# EAGLE design tm7_revG (EAGLE 9.6.2)
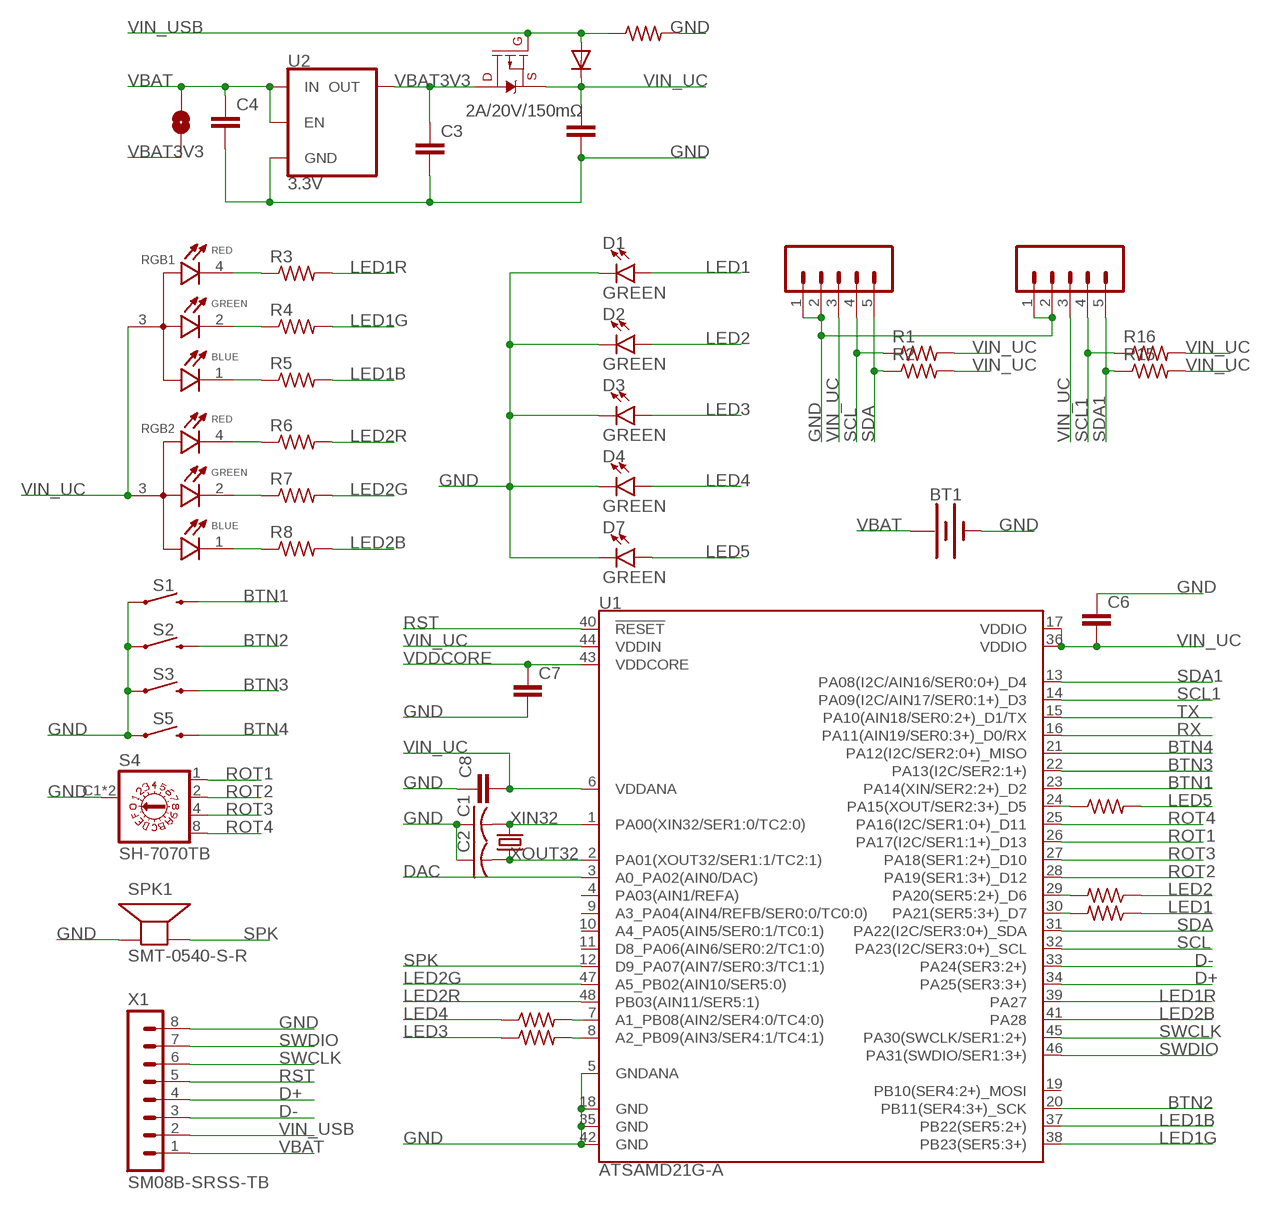
[diagram p0: schematic, sheet 1]

## Parts
BT1  BATTERY-20MM_SMD_4LEGS_OVERPASTE_INNER  [BATTCON_20MM_4LEGS_OVERPASTE_INNER]
C1  C-USC0603  [C0603]
C2  C-USC0603  [C0603]
C3  C-EUC0603  [C0603]
C4  C-EUC0603  [C0603]
C6  C-EUC0603  [C0603]
C7  C-EUC0603  [C0603]
C8  C-EUC0603  [C0603]
C9  C-EUC0603  [C0603]
D1  GREEN  LED-GREEN1206  [LED-1206]
D2  GREEN  LED-GREEN1206  [LED-1206]
D3  GREEN  LED-GREEN1206  [LED-1206]
D4  GREEN  LED-GREEN1206  [LED-1206]
D7  GREEN  LED-GREEN1206  [LED-1206]
D8  DIODESOD-323F  [SOD-323F]
JP1  JUMPER-SMT_2_NO_NO-SILK  [SMT-JUMPER_2_NO_NO-SILK]
LCD1  CONN_05VERT_FEMALE_HEADER  [1X05_SMD_VERTICAL_COMBO]
LCD2  CONN_05VERT_FEMALE_HEADER  [1X05_SMD_VERTICAL_COMBO]
Q1  2A/20V/150mΩ  MOSFET_PCH_DUAL-DMP2240UDM  [SOT26]
R1  R-US_R0603  [R0603]
R2  R-US_R0603  [R0603]
R3  R-US_R0603  [R0603]
R4  R-US_R0603  [R0603]
R5  R-US_R0603  [R0603]
R6  R-US_R0603  [R0603]
R7  R-US_R0603  [R0603]
R8  R-US_R0603  [R0603]
R9  R-US_R0603  [R0603]
R10  R-US_R0603  [R0603]
R11  R-US_R0603  [R0603]
R12  R-US_R0603  [R0603]
R13  R-US_R0603  [R0603]
R14  R-US_R0603  [R0603]
R15  R-US_R0603  [R0603]
R16  R-US_R0603  [R0603]
RGB1  EAST1616RGBA3  [LED_EAST1616RGBA3]
RGB2  EAST1616RGBA3  [LED_EAST1616RGBA3]
S1  MOMENTARY-SWITCH-SPST-SMD-6.0X3.5MM  [TACTILE_SWITCH_SMD_6.0X3.5MM]
S2  MOMENTARY-SWITCH-SPST-SMD-6.0X3.5MM  [TACTILE_SWITCH_SMD_6.0X3.5MM]
S3  MOMENTARY-SWITCH-SPST-SMD-6.0X3.5MM  [TACTILE_SWITCH_SMD_6.0X3.5MM]
S4  SH-7070TB  [SH-7070B]
S5  MOMENTARY-SWITCH-SPST-SMD-6.0X3.5MM  [TACTILE_SWITCH_SMD_6.0X3.5MM]
SPK1  SMT-0540-S-R  [SMT-0540-S-R]
U1  ATSAMD21G-A  [TQFP-48]
U2  3.3V  V_REG_AP2112K-3.3V  [SOT23-5]
X1  SM08B-SRSS-TB  [SM08B-SRSS-TB]
Y1  32.768kHz  CRYSTAL-32.768KHZSMD-3.2X1.5  [CRYSTAL-SMD-3.2X1.5MM]

## Nets
BTN1: S1.2 U1.23(PA14(XIN/SER2:2+)_D2)
BTN2: S2.2 U1.20(PB11(SER4:3+)_SCK)
BTN3: S3.2 U1.22(PA13(I2C/SER2:1+))
BTN4: S5.2 U1.21(PA12(I2C/SER2:0+)_MISO)
D+: U1.34(PA25(SER3:3+)) X1.4
D-: U1.33(PA24(SER3:2+)) X1.3
DAC: U1.3(A0_PA02(AIN0/DAC))
GND: BT1.2(-) C1.1 C2.1 C3.2 C4.2 C6.1 C7.2 C8.1 C9.2 D1.C D2.C D3.C D4.C D7.C LCD1.1 LCD1.2 LCD2.1 LCD2.2 R14.2 S1.1 S2.1 S3.1 S4.C1(C) S4.C2(C) S5.1 SPK1.-(+) U1.5(GNDANA) U1.18(GND) U1.35(GND) U1.42(GND) U2.2(GND) X1.8
LED1: D1.A R9.1
LED1B: R5.2 U1.37(PB22(SER5:2+))
LED1G: R4.2 U1.38(PB23(SER5:3+))
LED1R: R3.2 U1.39(PA27)
LED2: D2.A R10.1
LED2B: R8.2 U1.41(PA28)
LED2G: R7.2 U1.47(A5_PB02(AIN10/SER5:0))
LED2R: R6.2 U1.48(PB03(AIN11/SER5:1))
LED3: D3.A R11.1
LED4: D4.A R12.1
LED5: D7.A R13.2
N$1: R12.2 U1.7(A1_PB08(AIN2/SER4:0/TC4:0))
N$2: R11.2 U1.8(A2_PB09(AIN3/SER4:1/TC4:1))
N$3: R9.2 U1.30(PA21(SER5:3+)_D7)
N$4: R10.2 U1.29(PA20(SER5:2+)_D6)
N$5: R3.1 RGB1.4(R_C)
N$6: R4.1 RGB1.2(G_C)
N$7: R5.1 RGB1.1(B_C)
N$8: R6.1 RGB2.4(R_C)
N$9: R7.1 RGB2.2(G_C)
N$10: R8.1 RGB2.1(B_C)
N$11: R13.1 U1.24(PA15(XOUT/SER2:3+)_D5)
ROT1: S4.1 U1.26(PA17(I2C/SER1:1+)_D13)
ROT2: S4.2 U1.28(PA19(SER1:3+)_D12)
ROT3: S4.4 U1.27(PA18(SER1:2+)_D10)
ROT4: S4.8 U1.25(PA16(I2C/SER1:0+)_D11)
RST: U1.40(!RESET!) X1.5
RX: U1.16(PA11(AIN19/SER0:3+)_D0/RX)
SCL: LCD1.4 R1.1 U1.32(PA23(I2C/SER3:0+)_SCL)
SCL1: LCD2.4 R16.1 U1.14(PA09(I2C/AIN17/SER0:1+)_D3)
SDA: LCD1.5 R2.1 U1.31(PA22(I2C/SER3:0+)_SDA)
SDA1: LCD2.5 R15.1 U1.13(PA08(I2C/AIN16/SER0:0+)_D4)
SPK: SPK1.+(-) U1.12(D9_PA07(AIN7/SER0:3/TC1:1))
SWCLK: U1.45(PA30(SWCLK/SER1:2+)) X1.6
SWDIO: U1.46(PA31(SWDIO/SER1:3+)) X1.7
TX: U1.15(PA10(AIN18/SER0:2+)_D1/TX)
VBAT: BT1.1(+) C4.1 JP1.2 U2.1(IN) U2.3(EN) X1.1
VBAT3V3: C3.1 JP1.1 Q1.D1(A:D) U2.5(OUT)
VDDCORE: C7.1 U1.43(VDDCORE)
VIN_UC: C6.2 C8.2 C9.1 D8.C LCD1.3 LCD2.3 Q1.S1(A:S) R1.2 R2.2 R15.2 R16.2 RGB1.3(A) RGB2.3(A) U1.6(VDDANA) U1.17(VDDIO) U1.36(VDDIO) U1.44(VDDIN)
VIN_USB: D8.A Q1.G1(A:G) R14.1 X1.2
XIN32: C1.2 U1.1(PA00(XIN32/SER1:0/TC2:0)) Y1.P$2
XOUT32: C2.2 U1.2(PA01(XOUT32/SER1:1/TC2:1)) Y1.P$1
Unconnected: Q1.D2(B:D) Q1.G2(B:G) Q1.S2(B:S) U1.4(PA03(AIN1/REFA)) U1.9(A3_PA04(AIN4/REFB/SER0:0/TC0:0)) U1.10(A4_PA05(AIN5/SER0:1/TC0:1)) U1.11(D8_PA06(AIN6/SER0:2/TC1:0)) U1.19(PB10(SER4:2+)_MOSI)

## Library data of the parts
BT1 = SparkFun-Batteries:BATTERY: Battery - Single Cell A variety of battery chemistries, sizes, and footprints. Device List: 20MM_PTH - Coin Cell Battery Holder - 20mm (PTH) <https://www.sparkfun.com/products/783> 20MM_PTH_KIT- Coin Cell battery Holder - 20 mm (PTH) <http://www.sparkfun.com/products/783>kit version with special mask 6.8MM_PTH - Coin Cell Battery Holder - 6.8MM(SMD) <https://www.digikey.com/product-detail/en/seiko-instruments/MS621FE-FL11E/728-1057-ND/1889208?WT.srch=1&gclid=CNOQ5a6LzdQCFZS2wAodXCkE0g> 12MM_SMD - Coin Cell Battery Holder - 12mm (SMD) <https://www.sparkfun.com/products/10592> 12MM_PTH - Coin Cell Battery Holder - 12mm (PTH) <https://www.sparkfun.com/products/7948> 20MM_SMD - 20mm Coin Cell Battery Holder (SMD) (2 legs) Used on the Big Time Watch Kit <https://www.sparkfun.com/products/11734> 20MM_SMD_4LEGS - Coin Cell Battery Holder - 20mm (SMD) <https://www.sparkfun.com/products/11892> 20MM_SMD_4LEGS_OVERPASTE - Coin Cell Battery Holder - 20mm (SMD) <https://www.sparkfun.com/products/11892> (Over-paste on the legs) 24.5MM_PTH - Coin Cell Battery Holder - 24.5mm (PTH) <https://www.sparkfun.com/products/8863> 9V - 9V Battery Holder - PC Mount Used on the SparkFun SparkPunk Sound Kit <https://www.sparkfun.com/products/11177> and SparkFun SparkPunk Sequencer Kit <https://www.sparkfun.com/products/12707> 18650 - Battery Holder - 18650 (PTH) <https://www.sparkfun.com/products/13113> AA - Battery Holder - 1xAA (PTH) <https://www.sparkfun.com/products/7949> AAA - Battery Holder - 1xAAA (PTH) <https://www.sparkfun.com/products/12718> AA_KIT - Battery Holder - 1xAA (PTH) <https://www.sparkfun.com/products/7949> Special kit package - pads only have exposed copper on one side of the board. AAA_KIT - Battery Holder - 1xAAA (PTH) <https://www.sparkfun.com/products/12718> Special kit package - pads only have exposed copper on one side of the board.
C1 C2 = adafruit:C-US: CAPACITOR, American symbol
C3 C4 C6-C9 = rcl:C-EU: CAPACITOR, European symbol; SPICEPREFIX: C
D1-D4 D7 = SparkFun-LED:LED-GREEN: Green SMD LED Used in manufacturing of various products at SparkFun Packages: 0603 - SMD 0603 package [Product Link] <http://www.futureelectronics.com/en/technologies/semiconductors/optoelectronics/leds/Pages/9894312-LTST-C190GKT.aspx?CrossPart=HSMG-C190&IM=0> LilyPad 1206 - SMD1206 LilyPad package [Product Link] <http://www.futureelectronics.com/en/Technologies/Product.aspx?ProductID=IN150NGHARVATEKCORPORATION2049943&IM=0> 1206 - SMD1206 package [Product Link] <http://www.futureelectronics.com/en/technologies/semiconductors/optoelectronics/leds/Pages/8315665-LTST-C150KGKT.aspx?IM=0> 1206 Bottom Mount -SMD 1206 Bottom Mount [Product Link] <http://www.digikey.com/product-detail/en/lite-on-inc/LTST-C230KGKT/160-1456-1-ND/386854> SparkFun Products: Pro Mini 328 -5V <https://www.sparkfun.com/products/821> RedBoard <https://www.sparkfun.com/products/12757> MP3 Trigger <https://www.sparkfun.com/products/13720> Makey Makey <https://www.sparkfun.com/products/11076>; PROD_ID: DIO-00862
D8 = adafruit:DIODE: Diode SMADIODE - SMA Surface Mount Package 20V 1A Schottky Diode Digikey: 641-1014-6-ND DO-1N4148 - Through Hole Small Current Diode SOD-123 20V 1 A (.5mV Vf) Schottky Diode - Digikey: MBRX120TPMSCT-ND SOD-323 10V 570mA (.38mV Vf, 3ns) Schottky Diode - Digikey: ZLLS410CT-ND SOD-523 30V 30mA Schottky Diode (RB751S-40TE61) - Digikey: RB751S-40TE61CT-ND SOT23-R/W - SOT23 Package (R = Solder Paste/Reflow Ovens, W = Hand-Soldering) BAT54Film 40V 300mA - Digikey: 497-7162-1-ND
JP1 = SparkFun-Jumpers:JUMPER-SMT_2_NO: Normally open jumper This jumper has two pads in close proximity to each other. Apply solder to close the connection. Round pads are easier to solder for beginners, but are a lot larger. SparkFun Product that uses the round pads: SparkFun EL Sequencer <https://www.sparkfun.com/products/12781>
LCD1 LCD2 = SparkFun-Connectors:CONN_05: Multi connection point. Often used as Generic Header-pin footprint for 0.1 inch spaced/style header connections On any of the 0.1 inch spaced packages, you can populate with these: Break Away Headers - Straight <https://www.sparkfun.com/products/116> (PRT-00116) Break Away Male Headers - Right Angle <https://www.sparkfun.com/products/553> (PRT-00553) Female Headers <https://www.sparkfun.com/products/115> (PRT-00115) Break Away Headers - Machine Pin <https://www.sparkfun.com/products/117> (PRT-00117) Break Away Female Headers - Swiss Machine Pin <https://www.sparkfun.com/products/743> (PRT-00743) For SCREWTERMINALS and SPRING TERMINALS visit here: Screw Terimnals on SparkFun.com <https://www.sparkfun.com/search/results?term=Screw+Terminals> (5mm/3.5mm/2.54mm spacing) This device is also useful as a general connection point to wire up your design to another part of your project. Our various solder wires solder well into these plated through hole pads. Hook-Up Wire - Assortment (Stranded, 22 AWG) <https://www.sparkfun.com/products/11375> (PRT-11375) Hook-Up Wire - Assortment (Solid Core, 22 AWG) <https://www.sparkfun.com/products/11367> (PRT-11367) View the entire wire category on our website here <https://www.sparkfun.com/categories/141> Special notes: Molex polarized connector foot print use with SKU : PRT-08231 with associated crimp pins and housings. 1MM SMD Version SKU: PRT-10208; PROD_ID: CONN-15262
Q1 = SparkFun-DiscreteSemi:MOSFET_PCH_DUAL: Dual P-Channel -20VDS MOSFET Link to datasheet <http://www.diodes.com/_files/datasheets/ds31197.pdf> SparkFun Products: SparkFun FreeSoC2 Development Board <https://www.sparkfun.com/products/13229>; PROD_ID: TRANS-12444
R1-R13 R15 R16 = rcl:R-US_: RESISTOR, American symbol; SPICEPREFIX: R
R14 = adafruit:R-US_: RESISTOR, American symbol
RGB1 RGB2 = EAST1616RGBA3:EAST1616RGBA3: Red, Green, Blue (RGB) LED Indication - Discrete 1.95V Red, 2.8V Green, 2.8V Blue 0606 (1616 Metric) Check availability <https://pricing.snapeda.com/parts/EAST1616RGBA3/Everlight%20Electronics/view-part?ref=eda>; AVAILABILITY: In Stock; DESCRIPTION: Red, Green, Blue (RGB) - LED Indication - Discrete 1.95V Red, 2.8V Green, 2.8V Blue 0606 (1616 Metric); MF: Everlight Electronics; MP: EAST1616RGBA3; PACKAGE: 0606 Everlight; PRICE: None; PURCHASE-URL: https://pricing.snapeda.com/search/part/EAST1616RGBA3/?ref=eda
S1-S3 S5 = SparkFun-Switches:MOMENTARY-SWITCH-SPST: Momentary Switch (Pushbutton) - SPST Normally-open (NO) SPST momentary switches (buttons, pushbuttons). Variants PTH-12MM - 12mm square, through-hole Momentary Pushbutton Switch - 12mm Square <https://www.sparkfun.com/products/9190> (COM-09190) PTH-6.0MM, PTH-6.0MM-KIT - 6.0mm square, through-hole Mini Pushbutton Switch <https://www.sparkfun.com/products/97> (COM-00097) KIT package intended for soldering kit's - only one side of pads' copper is exposed. PTH-RIGHT-ANGLE-KIT - Right-angle, through-hole Right Angle Tactile Button <https://www.sparkfun.com/products/10791> - Used on SparkFun BigTime Watch Kit <https://www.sparkfun.com/products/11734> SMD-12MM - 12mm square, surface-mount Tactile Button - SMD (12mm) <https://www.sparkfun.com/products/12993> (COM-12993) Used on SparkFun PicoBoard <https://www.sparkfun.com/products/11888> SMD-4.5MM - 4.5mm Square Trackball Switch Used on SparkFun Blackberry Trackballer Breakout <https://www.sparkfun.com/products/13169> SMD-4.6MMX2.8MM - 4.60mm x 2.80mm, surface mount Used on SparkFun Pro Micro - RP2040 <https://www.sparkfun.com/products/17717> SMD-5.2MM, SMD-5.2-REDUNDANT - 5.2mm square, surface-mount Mini Pushbutton Switch - SMD <https://www.sparkfun.com/products/8720> (COM-08720) Used on Arduino Pro Mini <https://www.sparkfun.com/products/11114> REDUNDANT package connects both switch circuits together SMD-6.0X3.5MM - 6.0 x 3.5mm, surface mount Momentary Reset Switch SMD <https://www.sparkfun.com/products/8229> (COM-08229) SMD-6.2MM-TALL - 6.2mm square, surface mount Tactile Button - SMD (6mm) <https://www.sparkfun.com/products/12992> Used on SparkFun Digital Sandbox <https://www.sparkfun.com/products/12651> SMD-RIGHT-ANGLE - Right-angle, surface mount Used on SparkFun Block for Intel® Edison - Arduino <https://www.sparkfun.com/products/13036>; PROD_ID: SWCH-14278; SF_SKU: COM-08229
S4 = SH-7070TB:SH-7070TB: ROTARY CODED HEX SWITCH Check availability <https://pricing.snapeda.com/parts/SH-7070TB/Nidec%20Copal/view-part?ref=eda>; AVAILABILITY: In Stock; DESCRIPTION: Dip Switch Hexadecimal Complement 16 Position Surface Mount Rotary for Tool Actuator 100mA 5VDC; MF: Nidec Copal; MP: SH-7070TB; PACKAGE: None; PRICE: None; PURCHASE-URL: https://pricing.snapeda.com/search/part/SH-7070TB/?ref=eda
SPK1 = SMT-0540-S-R:SMT-0540-S-R: SMT-0549-S-R Small surface-mount magnetic buzzer Check availability <https://pricing.snapeda.com/parts/SMT-0540-S-R/PUI/view-part?ref=eda>; AVAILABILITY: In Stock; DESCRIPTION: SURFACE MOUNT TRANSDUCER 3V0-P 100MA; MF: PUI; MP: SMT-0540-S-R; PACKAGE: None; PRICE: None; PURCHASE-URL: https://pricing.snapeda.com/search/part/SMT-0540-S-R/?ref=eda
U1 = SparkFun-IC-Microcontroller:ATSAMD21G: Atmel SAMD21G SMART ARM-Based Microcontroller The Atmel ® | SMART ™ SAM D21 is a series of low-power microcontrollers using the 32-bit ARM ® Cortex ® -M0+ processor, and ranging from 32- to 64-pins with up to 256KB Flash and 32KB of SRAM. The SAM D21 devices operate at a maximum frequency of 48MHz and reach 2.46 CoreMark/MHz. They are designed for simple and intuitive migration with identical peripheral modules, hex compatible code, identical linear address map and pin compatible migration paths between all devices in the product series. All devices include intelligent and flexible peripherals, Atmel Event System for inter-peripheral signaling, and support for capacitive touch button, slider and wheel user interfaces. Datasheet <https://cdn.sparkfun.com/datasheets/Dev/Arduino/Boards/Atmel-42181-SAM-D21_Datasheet.pdf> SparkFun Products SparkFun SAMD21 Mini Breakout <https://www.sparkfun.com/products/13664> (DEV-13664) SparkFun SAMD21 Dev Breakout <https://www.sparkfun.com/products/13672> (DEV-13672) (DEV-14926); PROD_ID: IC-13064
U2 = SparkFun-IC-Power:V_REG_AP2112: AP2112 - 600mA CMOS LDO Regulator w/ Enable The AP2112 is CMOS process low dropout linear regulator with enable function, the regulator delivers a guaranteed 600mA (min.) continuous load current. Features Output Voltage Accuracy: ±1.5% Output Current: 600mA (Min.) Foldback Short Current Protection: 50mA Enable Function to Turn ON/OFF VOUT Low Dropout Voltage (3.3V): 250mV (Typ.) @IOUT=600mA Excellent Load Regulation: 0.2%/A (Typ.) Excellent Line Regulation: 0.02%/V (Typ.) Low Quiescent Current: 55μA (Typ.) Low Standby Current: 0.01μA (Typ.) Low Output Noise: 50μVRMS PSRR: 100Hz -65dB, 1kHz -65dB OTSD Protection Stable with 1.0μF Flexible Cap: Ceramic, Tantalum and Aluminum Electrolytic Operation Temperature Range: -40°C to 85°C ESD: MM 400V, HBM 4000V; PROD_ID: VREG-12457
X1 = con-JST:SM08B-SRSS: JST SH series header 1.00mm pitch disconnectable crimp style connectors, horizontal (side entry type), 8 pins
Y1 = SparkFun-Clocks:CRYSTAL-32.768KHZ: 32.768kHz Crystal Frequency: 32.768kHz Frequency Stability: ±20ppm Load Capacitance: 12.5pF (PTH-2X6 & SMD-3.2X1.5), 6pF (SMD-2X6) SparkFun Products: SparkFun BigTime Watch Kit <https://www.sparkfun.com/products/11734> SparkFun nRF52832 Breakout <https://www.sparkfun.com/products/13990> SparkFun Real Time Clock Module <https://www.sparkfun.com/products/12708>; PROD_ID: XTAL-13062

## Board
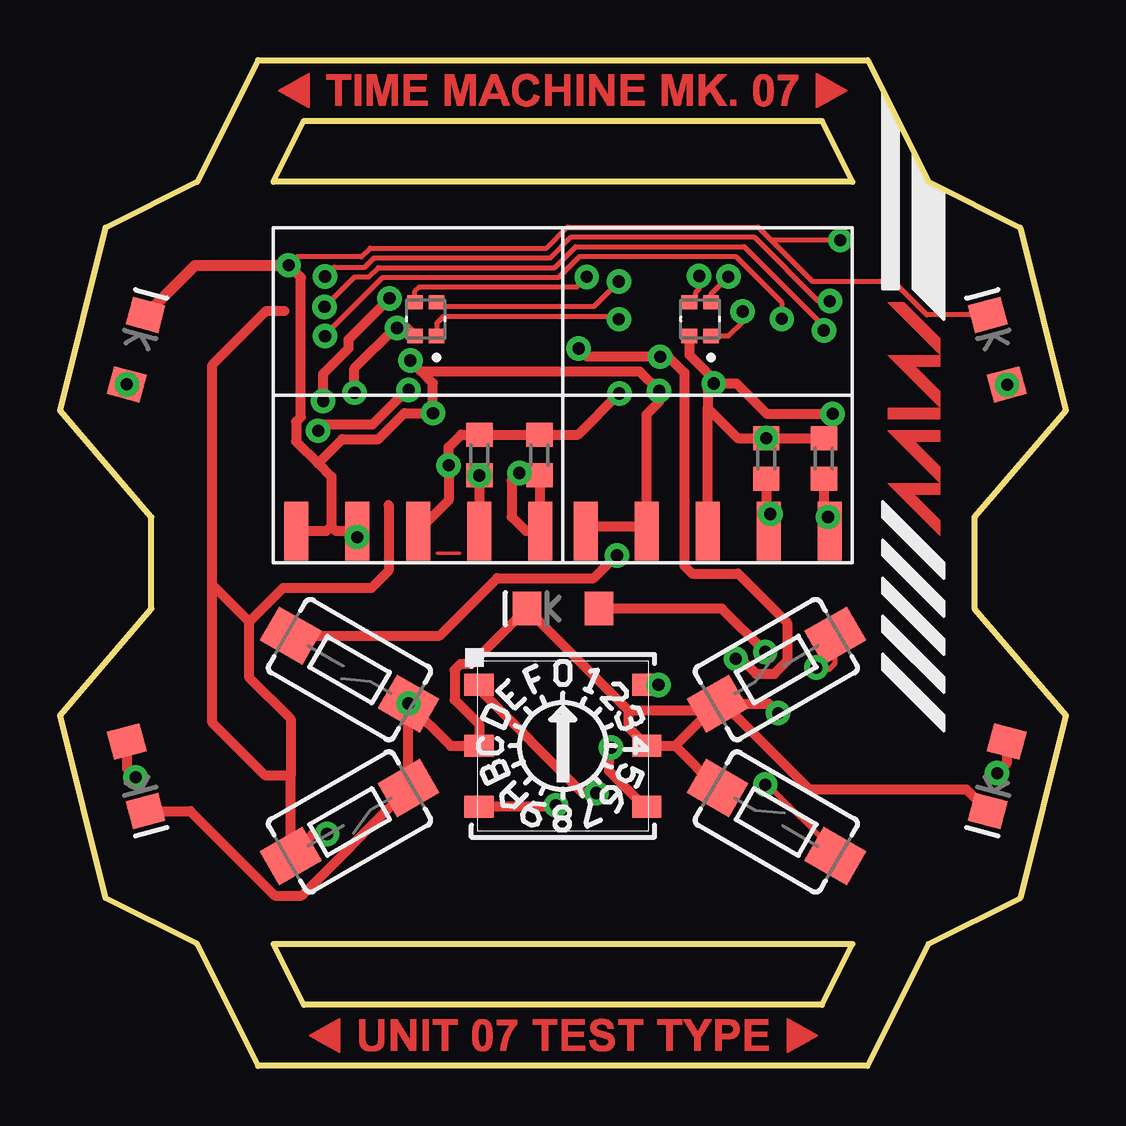
[diagram p1: board, top side]
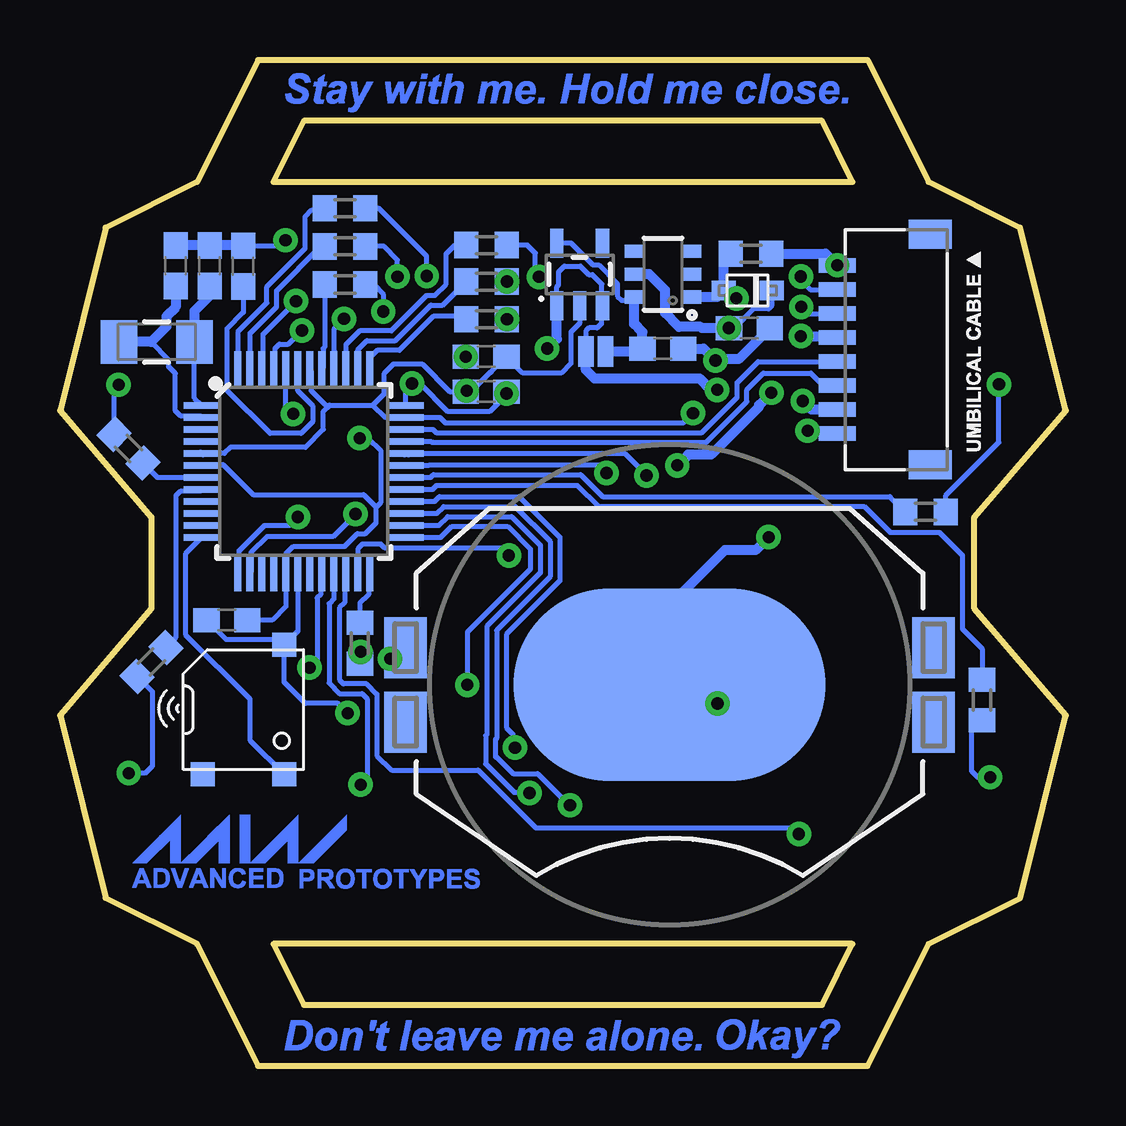
[diagram p2: board, bottom side, seen from below]

Size 41.91 x 41.91 mm. Coordinates in mm from the lower left corner, seen from the top.
Outline: 33.65,0 8.26,0 5.71,5.08 1.9,6.98 0,14.61 3.81,19.05 3.81,22.86 0,27.3 1.9,34.93 5.71,36.83 8.26,41.91 33.65,41.91 36.2,36.83 40.01,34.93 41.91,27.3 38.1,22.86 38.1,19.05 41.91,14.61 40.01,6.98 36.2,5.08 33.65,0
Outline: 8.89,36.83 10.16,39.37 31.75,39.37 33.02,36.83 8.89,36.83
Outline: 33.02,5.08 31.75,2.54 10.16,2.54 8.89,5.08 33.02,5.08
Copper layers (1*16): Top 0.035mm / dielectric 1.5mm / Bottom 0.035mm
Design rules "SparkFun": minimum track width 8mil, minimum drill 20mil, track to track 8mil, track to pad 8mil, pad to pad 8mil, via to via 8mil, smd to smd 8mil, copper to edge 10mil, drill to drill 8mil, minimum pad ring 12mil, minimum via ring 10mil, stop-mask expansion 4mil, vias tented up to drill 25mil, thermal gap 10mil

### Footprints (pad centres in the part's own frame; a part is rotated, then mirrored left to right if it is on the bottom)
BATTCON_20MM_4LEGS_OVERPASTE_INNER = smd 1.778 x 2.54: 1 -11,1.55; 3 11,1.55; P$1 -11,-1.55; P$2 11,-1.55 | smd 13 x 8: 2 0,0
C0603 = smd 1.1 x 1: 1 -0.85,0; 2 0.85,0
LED-1206 = smd 1.2 x 1.4: A -1.5,0; C 1.5,0
SOD-323F = smd 1 x 0.8: A -1,0; C 1,0
SMT-JUMPER_2_NO_NO-SILK = smd 0.635 x 1.27: 1 -0.406,0; 2 0.406,0
1X05_SMD_VERTICAL_COMBO = smd 1 x 2.438: 1 0,1.65; 2 2.54,1.65; 3 5.08,1.65; 4 7.62,1.652; 5 10.16,1.65
SOT26 = smd 0.55 x 0.8: D1 -0.95,1.2; D2 0.95,1.2; G1 -0.95,-1.2; G2 0.95,-1.2; S1 0,1.2; S2 0,-1.2
R0603 = smd 1 x 1.1: 1 -0.85,0; 2 0.85,0
LED_EAST1616RGBA3 = smd 0.6 x 0.65: 1 0.7,0.45; 2 -0.7,0.45; 3 0.7,-0.45; 4 -0.7,-0.45
TACTILE_SWITCH_SMD_6.0X3.5MM = smd 2.032 x 1.626: 1 -2.833,0; 2 2.833,0
SH-7070B = smd 1.219 x 0.914: 1 -2.223,3.81; 2 4.763,-1.27; 4 -2.223,-1.27; 8 4.763,3.81; C1 -2.223,1.27; C2 4.763,1.27
SMT-0540-S-R = smd 1 x 1: + 1.7,-2.7; - 1.7,2.7; M -1.7,-2.7
TQFP-48 = smd 1.5 x 0.28: 1 -4.25,2.75; 2 -4.25,2.25; 3 -4.25,1.75; 4 -4.25,1.25; 5 -4.25,0.75; 6 -4.25,0.25; 7 -4.25,-0.25; 8 -4.25,-0.75; 9 -4.25,-1.25; 10 -4.25,-1.75; 11 -4.25,-2.25; 12 -4.25,-2.75; 25 4.25,-2.75; 26 4.25,-2.25; 27 4.25,-1.75; 28 4.25,-1.25; 29 4.25,-0.75; 30 4.25,-0.25; 31 4.25,0.25; 32 4.25,0.75; 33 4.25,1.25; 34 4.25,1.75; 35 4.25,2.25; 36 4.25,2.75 | smd 0.28 x 1.5: 13 -2.75,-4.25; 14 -2.25,-4.25; 15 -1.75,-4.25; 16 -1.25,-4.25; 17 -0.75,-4.25; 18 -0.25,-4.25; 19 0.25,-4.25; 20 0.75,-4.25; 21 1.25,-4.25; 22 1.75,-4.25; 23 2.25,-4.25; 24 2.75,-4.25; 37 2.75,4.25; 38 2.25,4.25; 39 1.75,4.25; 40 1.25,4.25; 41 0.75,4.25; 42 0.25,4.25; 43 -0.25,4.25; 44 -0.75,4.25; 45 -1.25,4.25; 46 -1.75,4.25; 47 -2.25,4.25; 48 -2.75,4.25
SOT23-5 = smd 0.55 x 1.2: 1 -0.95,-1.3; 2 0,-1.3; 3 0.95,-1.3; 4 0.95,1.3; 5 -0.95,1.3
SM08B-SRSS-TB = smd 0.6 x 1.55: 1 3.5,0; 2 2.5,0; 3 1.5,0; 4 0.5,0; 5 -0.5,0; 6 -1.5,0; 7 -2.5,0; 8 -3.5,0 | smd 1.2 x 1.8: M1 4.8,3.875; M2 -4.8,3.875
CRYSTAL-SMD-3.2X1.5MM = smd 1.524 x 1.8: P$1 -1.567,0; P$2 1.567,0

### Placement (x,y rotation side)
BT1  16.51,15.88 0 bottom
C1  35.68,33.34 270 bottom
C2  37.1,33.34 270 bottom
C3  16.79,29.88 0 bottom
C4  24.16,29.55 0 bottom
C6  24.16,28.09 0 bottom
C7  34.27,33.32 90 bottom
C8  34.96,18.57 0 bottom
C9  13.19,30.74 0 bottom
D1  3.17,29.85 75 top
D2  3.17,12.07 285 top
D3  39.05,12.07 255 top
D4  39.05,29.85 105 top
D7  20.95,19.05 180 top
D8  13.26,32.3 0 bottom
JP1  19.59,29.77 180 bottom
LCD1  9.84,20.64 0 top
LCD2  21.91,20.64 0 top
Q1  16.78,32.99 90 bottom
R1  17.47,25.45 90 top
R2  19.97,25.45 90 top
R3  24.14,34.19 180 bottom
R4  24.14,32.68 180 bottom
R5  24.14,31.11 180 bottom
R6  30.04,35.73 180 bottom
R7  30.04,34.14 180 bottom
R8  30.04,32.56 180 bottom
R9  5.85,23.08 180 bottom
R10  3.49,15.24 90 bottom
R11  38.1,16.83 45 bottom
R12  39.05,25.72 315 bottom
R13  29.42,17.61 270 bottom
R14  13.12,33.84 0 bottom
R15  31.83,25.3 90 top
R16  29.43,25.3 90 top
RGB1  15.24,31.12 270 top
RGB2  26.67,31.12 270 top
S1  12.06,16.51 150 top
S2  29.84,16.51 30 top
S3  12.06,10.16 210 top
S4  19.68,12.07 0 top
S5  29.84,10.16 330 top
SPK1  34.27,14.84 0 bottom
U1  31.75,24.77 0 bottom
U2  20.26,32.98 0 bottom
X1  9.52,29.85 270 bottom
Y1  37.88,30.16 0 bottom

### Tracks (layer width: path | path; a pad name or v marks a point on that pad's centre or on a via)
BLOCK
  Top 0.152: 15.71,21.36 16.65,21.36
BLOCK2
  Top 0.102: 23.98,20.97 25.53,20.97
BTN1  (via drill 0.51)
  Top 0.406: S1.2 15.82,17.93 18.21,20.32 22.23,20.32 23.17,21.26 v23.21,21.26
  Bottom 0.203: U1.23 29.5,21.54 29.31,21.73 28.54,21.73 28.38,21.57 23.52,21.57 v23.21,21.26
BTN2  (via drill 0.51)
  Top 0.203: v31.51,16.59 31.59,16.52 32.04,16.52 32.3,16.77 S2.2
  Bottom 0.203: U1.20 31.05,20.46 31.05,19.64 31.2,19.5 31.2,16.91 v31.51,16.59
BTN3  (via drill 0.51)
  Top 0.203: 10.21,8.74 S3.2
  Top 0.406: 9.61,12.07 9.61,14.46 7.89,16.18 7.89,18.51 | 13.7,23.37 13.7,20.63 12.98,19.92 9.3,19.92 7.89,18.51 | v11.12,9.66 10.53,9.66 S3.2 9.61,12.07 | 7.89,18.51 6.35,20.05 | 6.35,20.05 6.35,29.21 8.6,31.46 9.35,31.46 | 6.35,20.05 6.35,14.3 8.54,12.11 9.57,12.11 9.61,12.07
  Bottom 0.203: U1.22 30.05,20.46 30.05,19.3 30.27,19.08 30.27,16.09 30.1,15.92 29.13,15.92 28.7,15.49 28.7,12.93 28.09,12.32 24.49,12.32 22.09,9.92 11.39,9.92 v11.12,9.66
BTN4  (via drill 0.51)
  Top 0.203: v29.38,11.72 29.5,11.72 32.3,8.92 S5.2
  Bottom 0.203: U1.21 30.5,19.46 30.7,19.26 30.7,15.94 30.27,15.51 29.32,15.51 29.11,15.3 29.11,11.99 v29.38,11.72
D+
  Bottom 0.203: U1.34 26.37,26.52 26.24,26.38 15.16,26.38 13.7,27.85 13.7,28.46 12.82,29.35 X1.4
D-
  Bottom 0.203: U1.33 26.44,26.02 26.41,25.98 14.99,25.98 13.29,27.68 13.29,28.17 12.61,28.86 10.63,28.86 10.11,28.35 X1.3
GND  (via drill 0.51)
  Top 0.203: 24.84,22.29 LCD2.2 | S1.1 14.6,15.18 | 12.38,21.94 v12.38,22.03 12.38,22.17 LCD1.2 12.58,22.49 | 24.45,27.19 24.45,27.15 | 38.66,31.47 D4.C 36.12,31.29 34.74,32.67 31.36,32.67 29.63,34.4 | v9.52,33.36 9.87,33.7 12.55,33.7 12.92,34.07 20.27,34.07 21.14,34.94 29.09,34.94 29.62,34.41 29.63,34.4 | v32.51,34.4 29.63,34.4
  Top 0.406: D3.C 37.77,11.51 31.23,11.51 27.65,15.09 S2.1 | S2.1 29.53,15.09 v29.92,14.7 | 25.63,13.33 S4.C2 23.7,14.08 23.7,14.81 | 25.63,13.33 S2.1 | 25.63,13.33 S5.1 | 23.7,14.81 27.1,14.81 S2.1 | 23.7,14.81 D7.C 17.14,16.74 16.68,16.74 16.45,16.5 16.45,15.24 17.46,14.23 S4.C1 16.28,13.33 S1.1 S3.1 14.19,11.25 14.19,11.23 10.06,7.1 8.96,7.1 5.44,10.62 D2.C | 12.27,22.29 12.38,22.17 | LCD1.2 v12.38,22.03 | 12.41,22.32 LCD1.2 | v9.52,33.36 10.03,32.85 10.03,27.03 9.84,26.84 9.84,26.01 10.75,25.1 | LCD2.2 24.45,22.48 | 24.45,22.48 24.45,27.15 24.97,27.66 v24.97,28.13 24.16,28.93 15.37,28.93 | 15.37,28.93 15.05,28.93 v14.6,29.39 | 11.3,22.48 11.3,24.55 10.75,25.1 | 11.3,22.48 11.49,22.29 LCD1.2 | 10.75,25.1 11.76,26.11 13.26,26.11 14.35,27.2 v15.54,27.2 15.54,28.45 15.05,28.93 15.37,28.93 | LCD1.1 11.11,22.29 11.3,22.48 | LCD2.1 22.1,22.48 24.45,22.48
  Top 0.457: D1.C 5.63,33.36 v9.52,33.36
  Bottom 0.203: U1.18 32,18.11 SPK1.- | SPK1.- 32.8,17.77 35,17.77 C8.1 | 35.95,25.46 U1.5 | v29.92,14.7 30.33,15.1 31.69,15.1 32.57,15.99 SPK1.- | 15.37,17.01 15.98,16.4 BT1.2 | U1.42 31.45,28.96 31.45,28.14 30.84,27.53 30.67,27.53 | 30.67,27.53 28.87,27.53 | 28.87,27.53 28.36,27.02 U1.35 26.08,27.02 25.86,26.79 15.95,26.79 v15.54,27.2 | U1.5 36.05,25.57 | 14.66,29.44 v14.6,29.39 | C6.1 25.66,28.09 26.82,29.24 28.01,29.24 28.4,28.85 28.4,28 28.87,27.53 | C6.1 v24.97,28.13 | U2.2 20.26,30.93 20.62,30.57 20.62,29.27 21.03,28.86 22.62,28.86 C4.2 23.96,28.89 23.98,28.89 24.79,28.09 C6.1 | U1.5 35.06,25.52 34.79,25.78 31.68,25.78 | 30.67,27.53 30.93,27.27 30.93,26.52 31.68,25.78 | 31.68,25.77 31.68,25.78 | C7.2 32.74,34.17 v32.51,34.4
  Bottom 0.406: BT1.2 15.3,15.87 S1.1 | 9.52,33.48 v9.52,33.36 10.01,33.84 R14.2 | C3.2 15.1,29.88 14.66,29.44 13.64,29.44 C9.2 | C7.2 34.29,34.19 C1.1 C2.1 37.1,34.11 | v12.38,22.03 12.92,21.49 14.21,21.49 15.98,19.72 15.98,16.4
  Bottom 0.457: v9.52,33.36 X1.8
  other vias: 14.52,15.09
LED1  (via drill 0.51)
  Bottom 0.203: 4.77,23.31 R9.1 5,23.77 2.79,25.98 D1.A
  other vias: 2.79,28.4
LED1B
  Bottom 0.203: U1.37 29,29.5 28.7,29.81 27.77,29.81 26.33,31.25 25.13,31.25 R5.2
LED1G
  Bottom 0.203: U1.38 29.5,29.84 29.12,30.21 27.94,30.21 26.46,31.69 25.97,31.69 R4.2
LED1R
  Bottom 0.203: U1.39 30,30.05 29.43,30.62 28.1,30.62 26.63,32.1 26.29,32.1 25.82,32.58 25.82,33.83 25.45,34.19 R3.2
LED2  (via drill 0.51)
  Top 0.406: D2.A 2.79,12.39 v3.15,12.02
  Bottom 0.203: R10.1 3.92,13.96 3.92,12.28 3.67,12.02 v3.15,12.02
LED2B
  Bottom 0.203: 31,32.44 R8.2 30.89,29.95 30.95,29.89 30.95,29.07 U1.41
LED2G
  Bottom 0.203: 31.01,34.27 R7.2 31.04,34.14 32.89,32.3 32.89,31.62 34,30.51 U1.47
LED2R
  Bottom 0.203: 31.1,35.51 30.96,35.66 | 30.96,35.66 R6.2 | U1.48 34.5,30.59 33.29,31.79 33.29,32.47 31.7,34.06 31.7,35.38 31.41,35.66 30.96,35.66
LED3  (via drill 0.51)
  Top 0.203: 39.05,13.12 D3.A
  Top 0.406: D3.A 39.44,12.59 v39.05,12.2
  Bottom 0.203: R11.1 38.07,15.59 38.07,12.49 38.36,12.2 v39.05,12.2
LED4  (via drill 0.51)
  Top 0.203: D4.A 39.45,28.4 v39.47,28.38
  Bottom 0.203: R12.1 39.65,28.19 v39.47,28.38
LED5  (via drill 0.51)
  Top 0.406: v29.38,17.25 27.58,19.05 D7.A
  Bottom 0.203: v29.38,17.25 29.42,17.22 R13.2
N$1
  Bottom 0.203: R12.2 37.85,24.52 U1.7
N$2
  Bottom 0.203: R11.2 37.07,17.86 37.07,23.77 36.88,23.96 36.05,23.96 U1.8
N$3
  Bottom 0.203: 6.99,23.37 R9.2 7.33,23.71 19.3,23.71 20.22,24.63 26.35,24.63 26.47,24.52 U1.30
N$4
  Bottom 0.203: U1.29 26.39,24.02 26.21,24.19 20.35,24.19 19.47,23.31 8.41,23.31 7.32,22.22 5.27,22.22 4.32,21.27 4.32,18.2 3.49,17.38 R10.2
N$5  (via drill 0.51)
  Top 0.203: RGB1.4 14.79,32.28 14.96,32.45 21.52,32.45 v21.95,32.88
  Bottom 0.203: R3.1 22.43,34.19 22.1,33.86 22.1,33.03 v21.95,32.88
N$6  (via drill 0.51)
  Top 0.203: R4.1 22.24,31.63 15.87,31.63 RGB1.2
  other vias: 23.29,32.68
N$7  (via drill 0.51)
  Top 0.203: R5.1 23.18,31.21 15.97,31.21 15.69,30.93 RGB1.1
  other vias: 23.29,31.11
N$8  (via drill 0.51)
  Top 0.203: v26.63,32.91 26.63,32.38 26.49,32.24 26.49,32.09 RGB2.4
  Bottom 0.203: 26.63,33.15 v26.63,32.91 26.63,33.73 28.63,35.73 R6.1
N$9  (via drill 0.51)
  Top 0.203: RGB2.2 27.12,32.15 v27.85,32.88
  Bottom 0.203: v27.85,32.88 27.85,33.58 28.41,34.14 R7.1
N$10  (via drill 0.51)
  Top 0.203: RGB2.1 27.85,30.41 28.44,31.01 v28.44,31.43
  Bottom 0.203: R8.1 28.84,32.56 28.44,32.16 v28.44,31.43
N$11
  Bottom 0.203: U1.24 29.05,20.46 29.05,19.64 29.42,19.28 R13.1
ROT1  (via drill 0.51)
  Top 0.406: 17.63,15.87 S4.1 17.46,15.68 21.78,11.37 v22.35,11.37
  Bottom 0.203: U1.26 26.13,22.51 25.76,22.89 23.09,22.89 21.89,21.69 21.89,20.55 24.13,18.31 24.13,13.81 24.17,13.76 24.17,12.58 22.98,11.39 22.37,11.39 v22.35,11.37
ROT2  (via drill 0.51)
  Top 0.406: v22.95,13.26 22.87,13.17 22.87,12.29 24.36,10.79 S4.2
  Bottom 0.203: U1.28 26.3,23.52 26.1,23.72 22.77,23.72 21.08,22.02 21.08,20.21 23.31,17.98 23.31,14.09 23.04,13.82 23.04,13.34 v22.95,13.26
ROT3  (via drill 0.51)
  Top 0.203: v20.66,10.86 20.6,10.79
  Top 0.406: 20.6,10.79 S4.4
  Bottom 0.203: U1.27 26.21,23.01 25.93,23.3 22.93,23.3 21.49,21.86 21.49,20.38 23.72,18.14 23.72,13.64 23.77,13.6 23.77,12.92 | 23.77,12.92 23.77,12.87 | v20.66,10.86 20.69,10.86 22.01,12.18 23.02,12.18 23.77,12.92
ROT4  (via drill 0.51)
  Top 0.203: v24.94,15.87 S4.8
  Bottom 0.203: U1.25 26.05,22.01 25.59,22.48 23.26,22.48 22.31,21.53 22.31,20.7 24.94,18.07 v24.94,15.87
RST  (via drill 0.51)
  Top 0.203: v30.07,31.12 30.07,31.81 28.16,33.72 21.65,33.72 20.78,32.85 13.45,32.85 11.04,30.44 v11.04,30.4
  Bottom 0.203: U1.40 30.5,29.76 30.48,29.78 30.48,30.72 v30.07,31.12 | 9.58,30.4 X1.5
  Bottom 0.406: v11.04,30.4 9.58,30.4
SCL  (via drill 0.51)
  Top 0.406: 17.42,22.33 LCD1.4 17.47,22.3 R1.1
  Bottom 0.203: U1.32 27.33,25.52 27.38,25.46 | U1.32 27.55,25.46 | U1.32 18.39,25.52 R1.1
  other vias: 17.47,24.6
SCL1  (via drill 0.51)
  Top 0.406: LCD2.4 29.51,22.31 | R16.1 29.43,23.16 v29.6,22.99 29.6,22.36 LCD2.4 | LCD2.4 29.53,22.99 29.51,23.01
  Bottom 0.203: v29.6,22.99 30.53,22.05 33.28,22.05 33.95,21.39 33.95,20.57 U1.14
SDA  (via drill 0.51)
  Top 0.406: 19.89,22.17 LCD1.5 | R2.1 19.63,24.6 | LCD1.5 20,22.56 | R2.1 20,24.57 LCD1.5 | LCD1.5 19.41,22.29 18.82,22.88 18.82,24.38 v19.14,24.7 19.87,24.7 R2.1
  Bottom 0.203: U1.31 26.55,25.02 26.52,25.04 19.48,25.04 v19.14,24.7
SDA1  (via drill 0.51)
  Top 0.203: 32.01,22.35 LCD2.5
  Top 0.406: R15.1 31.83,23.04 v32,22.87 32,22.36 LCD2.5
  Bottom 0.203: U1.13 34.45,20.57 34.45,21.47 33.39,22.52 32.34,22.52 v32,22.87
SPK
  Bottom 0.203: SPK1.+ 34,13.57 34,15.29 36.66,17.95 36.66,21.35 U1.12
SWCLK  (via drill 0.51)
  Top 0.203: v31.83,30.64 31.83,30.81 28.51,34.13 21.48,34.13 20.61,33.26 13.26,33.26 12.87,32.87 12.27,32.87 v11.02,31.62
  Bottom 0.203: U1.45 32.95,29.07 32.95,29.89 32.77,30.07 32.4,30.07 v31.83,30.64 | v11.02,31.62 10.74,31.35 X1.6
SWDIO  (via drill 0.51)
  Top 0.203: v32.08,31.86 31.6,31.86 28.92,34.54 21.31,34.54 20.44,33.67 13.09,33.67 12.7,33.28 11.43,33.28 v11.04,32.89
  Bottom 0.203: U1.46 33.45,29.07 33.45,30.49 v32.08,31.86 | v11.04,32.89 11.04,32.75 10.64,32.35 X1.7
VBAT  (via drill 0.51)
  Top 0.406: v28.15,16.96 28.37,16.96 29.01,16.33 29.76,16.33 30.3,16.87 30.3,18.46 28.25,20.5 26.34,20.5 26.01,20.83 26.01,28.88 25.35,29.55 C4.1 21.95,29.55 v21.61,29.89 | v14.53,28.17 14.46,28.17 13.01,26.72 11.02,26.72 v10.76,26.46
  Bottom 0.203: BT1.1 27.69,17.43 v28.15,16.96 | U2.1 21.21,32.47 21.13,32.54 21.13,33.08 20.9,33.32 20.23,33.32 19.88,32.96 19.73,32.96 19.33,32.57 19.33,31.7 U2.3 19.35,31.63 19.35,30.92 19.53,30.75 19.87,30.75 20,30.62 JP1.2
  Bottom 0.406: v10.76,26.46 9.64,26.46 X1.1 | v14.53,28.17 14.79,28.17 15.26,28.64 19.64,28.64 20,29 JP1.2 | v21.61,29.89 21.21,30.29 U2.1
  other vias: 25.01,29.55
VBAT3V3
  Bottom 0.203: U2.5 20.61,34.28 19.71,33.37 19.47,33.37 18.69,32.59 18.69,32.07 18.51,31.89 18.13,31.89 Q1.D1 17.98,31.95
  Bottom 0.406: Q1.D1 17.98,30.92 17.64,30.57 C3.1 17.75,29.77 JP1.1
VDDCORE
  Bottom 0.203: 34.27,32.28 C7.1 34.27,31.39 34.95,30.72 34.95,28.14 33.16,26.35 31.86,26.35 31.38,26.83 31.38,27.5 32,28.12 U1.43
VIN_UC  (via drill 0.51)
  Top 0.406: 14.74,30.37 RGB1.3 14.46,30.74 C9.1 13.95,30.74 12.27,29.06 v12.27,28.05 | RGB2.3 26.22,29.63 27.24,28.6 v27.24,28.43 | R2.2 20,26.32 | v27.24,28.43 27.55,28.43 | v27.24,28.43 28.18,28.43 29.45,27.16 v32.2,27.16 | v27.24,28.43 26.99,28.18 26.99,27.4 | LCD2.3 26.99,27.4 | R1.2 R2.2 | R2.2 21.59,26.3 v23.3,28.02 | 17.28,26.3 R1.2 | 26.99,27.4 28.23,26.15 R16.2 R15.2 | LCD1.3 16.19,23.56 v16.19,25.02 16.19,25.78 16.71,26.3 R1.2
  Bottom 0.203: C9.1 13.82,30.74 13.01,31.55 12.38,31.55 12.26,31.67 D8.C | C6.2 v23.3,28.02 23.3,27.97 | 23.13,28.14 23.3,27.97 | U1.6 35.98,25.02 35.94,25.05 35.12,25.05 33.87,23.8 29.26,23.8 28.74,23.28 | v32.2,27.16 32.5,27.47 U1.44 | 28.74,23.28 28.74,22.63 29.19,22.18 29.52,22.18 30.05,21.65 32.19,21.65 32.5,21.34 U1.17 32.5,19.14 33.07,18.57 C8.2 | U1.36 27.5,28.17 v27.24,28.43 26.92,28.43 25.78,27.28 23.99,27.28 23.3,27.97 | R16.2 29.06,26.15 28.55,25.65 28.55,23.47 28.74,23.28
  Bottom 0.406: v16.19,25.02 15.74,25.47 14.78,25.47 12.78,27.47 12.78,27.53 v12.27,28.05 | C9.1 14.79,30.74 14.8,30.73 15.17,30.73 15.22,30.79 16.12,30.79 16.7,31.37 16.7,32.32 17.37,32.99 Q1.S1
  other vias: 14.04,30.74 29.43,26.15
VIN_USB  (via drill 0.51)
  Top 0.203: v10.96,27.7 10.96,28.04
  Top 0.406: v13.73,31.98 12.02,30.27 12.02,29.9 10.96,28.84 v10.96,27.7
  Bottom 0.203: D8.A 13.94,31.98 v13.73,31.98
  Bottom 0.406: X1.2 10.61,27.35 v10.96,27.7 | Q1.G1 14.53,32.04 D8.A 14.26,33.54 R14.1
XIN32
  Bottom 0.203: 36.31,27.83 36.31,27.82 | 36.31,27.82 U1.1 | 36.31,27.82 Y1.P$2
  Bottom 0.406: 35.88,30.16 Y1.P$2 | C1.2 35.68,32.08 36.31,31.45 Y1.P$2
XOUT32
  Bottom 0.203: U1.2 36.05,27.07 36.88,27.07 37.1,27.29 37.1,28.86 37.38,29.14 37.38,29.43 38.12,30.16
  Bottom 0.406: C2.2 37.1,31.62 37.48,31.23 37.48,30.8 38.12,30.16 Y1.P$1
(copper drawn outside any net)
  shapes: Bottom area x11355, Top area x7499